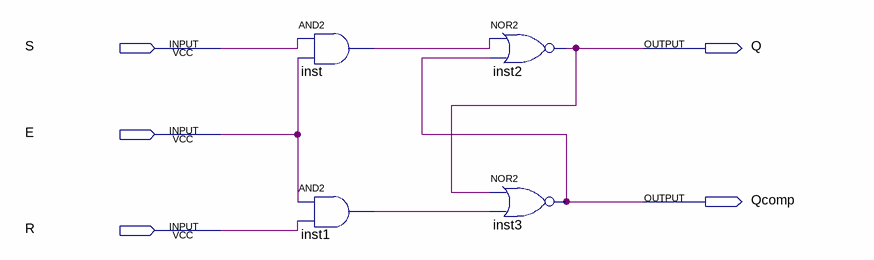
[diagram p0: schematic sheet]
// Quartus schematic exercise26.bdf as structural Verilog: 4 symbols, 5 pins
module exercise26 (
  input  S,
  input  E,
  input  R,
  output Q,
  output Qcomp
);

  wire inst1_out, inst_out;

  and inst (inst_out, S, E);
  and inst1 (inst1_out, E, R);
  nor inst2 (Q, inst_out, Qcomp);
  nor inst3 (Qcomp, Q, inst1_out);
endmodule
